# Altium schematic sheet CMV4000.SchDoc
size A4
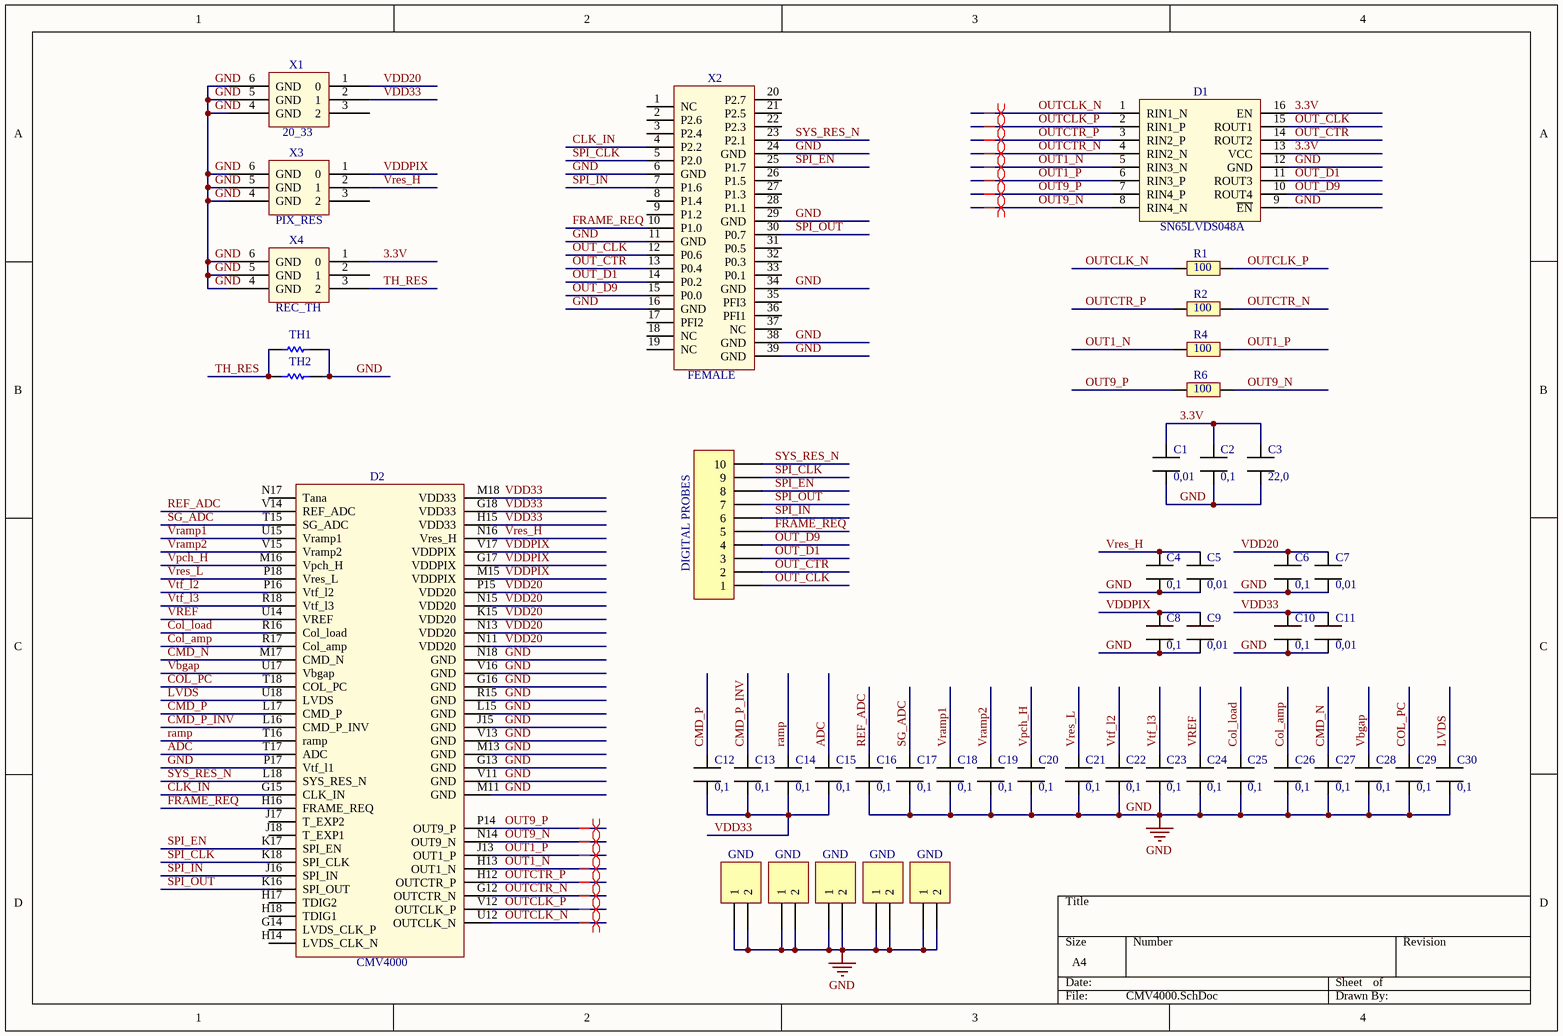
[diagram p0: CMV4000.SchDoc]

## Parts
C1  0,01  [CAP_SMALL]
C2  0,1  [CAP_SMALL]
C3  22,0  [Cap_BIG]
C4  0,1  [CAP_SMALL]
C5  0,01  [CAP_SMALL]
C6  0,1  [CAP_SMALL]
C7  0,01  [CAP_SMALL]
C8  0,1  [CAP_SMALL]
C9  0,01  [CAP_SMALL]
C10  0,1  [CAP_SMALL]
C11  0,01  [CAP_SMALL]
C12  0,1  [CAP_SMALL]
C13  0,1  [CAP_SMALL]
C14  0,1  [CAP_SMALL]
C15  0,1  [CAP_SMALL]
C16  0,1  [CAP_SMALL]
C17  0,1  [CAP_SMALL]
C18  0,1  [CAP_SMALL]
C19  0,1  [CAP_SMALL]
C20  0,1  [CAP_SMALL]
C21  0,1  [CAP_SMALL]
C22  0,1  [CAP_SMALL]
C23  0,1  [CAP_SMALL]
C24  0,1  [CAP_SMALL]
C25  0,1  [CAP_SMALL]
C26  0,1  [CAP_SMALL]
C27  0,1  [CAP_SMALL]
C28  0,1  [CAP_SMALL]
C29  0,1  [CAP_SMALL]
C30  0,1  [CAP_SMALL]
D1  SN65LVDS048A  [SN65LVDS048A (4LVDS)]
D2  CMV4000  [SOCKET_AM2]
P1  GND  [HDR1X2]
P2  GND  [HDR1X2]
P3  GND  [HDR1X2]
P4  GND  [HDR1X2]
P5  GND  [HDR1X2]
P6  DIGITAL PROBES  [HDR1X10]
R1  100  [RES]
R2  100  [RES]
R4  100  [RES]
R6  100  [RES]
TH1  Res Semi  [AXIAL-0.5]  (value not drawn)
TH2  Res Semi  [AXIAL-0.5]  (value not drawn)
X1  20_33  [POWER]
X2  FEMALE  [CHEAP_CONN_FEMALE]
X3  PIX_RES  [POWER]
X4  REC_TH  [POWER]

## Nets
GND: C1.1 C2.1 C3.1 C4.1 C5.1 C6.1 C7.1 C8.1 C9.1 C10.1 C11.1 C16.1 C17.1 C18.1 C19.1 C20.1 C21.1 C22.1 C23.1 C24.1 C25.1 C26.1 C27.1 C28.1 C29.1 C30.1 D1.9(~{EN}) D1.12(GND) D2.G13(GND) D2.G16(GND) D2.J15(GND) D2.L15(GND) D2.M11(GND) D2.M13(GND) D2.N18(GND) D2.P17(Vtf_l1) D2.R15(GND) D2.V11(GND) D2.V13(GND) D2.V16(GND) P1.1 P1.2 P2.1 P2.2 P3.1 P3.2 P4.1 P4.2 P5.1 P5.2 TH1.2 TH2.2 X1.4(GND) X1.5(GND) X1.6(GND) X2.6(GND) X2.11(GND) X2.16(GND) X2.24(GND) X2.29(GND) X2.34(GND) X2.38(GND) X2.39(GND) X3.4(GND) X3.5(GND) X3.6(GND) X4.4(GND) X4.5(GND) X4.6(GND)
3.3V: C1.2 C2.2 C3.2 D1.13(VCC) D1.16(EN) X4.1(0)
ADC: C15.2 D2.T17(ADC)
CLK_IN: D2.G15(CLK_IN) X2.4(P2.2)
CMD_N: C27.2 D2.M17(CMD_N)
CMD_P: C12.2 D2.L17(CMD_P)
CMD_P_INV: C13.2 D2.L16(CMD_P_INV)
Col_amp: C26.2 D2.R17(Col_amp)
Col_load: C25.2 D2.R16(Col_load)
COL_PC: C29.2 D2.T18(COL_PC)
FRAME_REQ: D2.H16(FRAME_REQ) P6.5 X2.10(P1.0)
LVDS: C30.2 D2.U18(LVDS)
OUT1_N: D1.5(RIN3_N) D2.H13(OUT1_N) R4.1
OUT1_P: D1.6(RIN3_P) D2.J13(OUT1_P) R4.2
OUT9_N: D1.8(RIN4_N) D2.N14(OUT9_N) R6.2
OUT9_P: D1.7(RIN4_P) D2.P14(OUT9_P) R6.1
OUT_CLK: D1.15(ROUT1) P6.1 X2.12(P0.6)
OUT_CTR: D1.14(ROUT2) P6.2 X2.13(P0.4)
OUT_D1: D1.11(ROUT3) P6.3 X2.14(P0.2)
OUT_D9: D1.10(ROUT4) P6.4 X2.15(P0.0)
OUTCLK_N: D1.1(RIN1_N) D2.U12(OUTCLK_N) R1.1
OUTCLK_P: D1.2(RIN1_P) D2.V12(OUTCLK_P) R1.2
OUTCTR_N: D1.4(RIN2_N) D2.G12(OUTCTR_N) R2.2
OUTCTR_P: D1.3(RIN2_P) D2.H12(OUTCTR_P) R2.1
ramp: C14.2 D2.T16(ramp)
REF_ADC: C16.2 D2.V14(REF_ADC)
SG_ADC: C17.2 D2.T15(SG_ADC)
SPI_CLK: D2.K18(SPI_CLK) P6.9 X2.5(P2.0)
SPI_EN: D2.K17(SPI_EN) P6.8 X2.25(P1.7)
SPI_IN: D2.J16(SPI_IN) P6.6 X2.7(P1.6)
SPI_OUT: D2.K16(SPI_OUT) P6.7 X2.30(P0.7)
SYS_RES_N: D2.L18(SYS_RES_N) P6.10 X2.23(P2.1)
TH_RES: TH1.1 TH2.1 X4.3(2)
Vbgap: C28.2 D2.U17(Vbgap)
VDD20: C6.2 C7.2 D2.K15(VDD20) D2.N11(VDD20) D2.N13(VDD20) D2.N15(VDD20) D2.P15(VDD20) X1.1(0)
VDD33: C10.2 C11.2 C12.1 C13.1 C14.1 C15.1 D2.G18(VDD33) D2.H15(VDD33) D2.M18(VDD33) X1.2(1)
VDDPIX: C8.2 C9.2 D2.G17(VDDPIX) D2.M15(VDDPIX) D2.V17(VDDPIX) X3.1(0)
Vpch_H: C20.2 D2.M16(Vpch_H)
Vramp1: C18.2 D2.U15(Vramp1)
Vramp2: C19.2 D2.V15(Vramp2)
VREF: C24.2 D2.U14(VREF)
Vres_H: C4.2 C5.2 D2.N16(Vres_H) X3.2(1)
Vres_L: C21.2 D2.P18(Vres_L)
Vtf_l2: C22.2 D2.P16(Vtf_l2)
Vtf_l3: C23.2 D2.R18(Vtf_l3)

Not connected (* = marked no-connect by the designer): D2 G14(LVDS_CLK_P) H14(LVDS_CLK_N) H17(TDIG2) H18(TDIG1) J17(T_EXP2) J18(T_EXP1) N17(Tana); X1 3(2); X2 1(NC) 2(P2.6) 3(P2.4) 8(P1.4) 9(P1.2) 17(PFI2) 18(NC) 19(NC) 20(P2.7) 21(P2.5) 22(P2.3) 26(P1.5) 27(P1.3) 28(P1.1) 31(P0.5) 32(P0.3) 33(P0.1) 35(PFI3) 36(PFI1) 37(NC); X3 3(2); X4 2(1)

## Layout directives
differential pair: OUT1_N, OUT1_P, OUT9_N, OUT9_P, OUTCLK_N, OUTCLK_P, OUTCTR_N, OUTCTR_P

## Library data of the parts
C1 C2 C4-C30 = CAP_SMALL
C3 = CAP_BIG
D1 = SN65LVDS048A (4LVDS)
P1-P5 = Header 2: Header, 2-Pin; LatestRevisionDate: 17-Jul-2002; LatestRevisionNote: Re-released for DXP Platform.; Publisher: Altium Limited
P6 = Header 10: Header, 10-Pin; LatestRevisionDate: 17-Jul-2002; LatestRevisionNote: Re-released for DXP Platform.; Publisher: Altium Limited
R1 R2 R4 R6 = RES
TH1 TH2 = Res Semi: Semiconductor Resistor; Value: 1K; Published: 8-Jun-2000; LatestRevisionDate: 17-Jul-2002; LatestRevisionNote: Re-released for DXP Platform.; PackageReference: AXIAL-0.5; Publisher: Altium Limited; PackageDescription: Axial Device, Thru-Hole; 2 Leads; 0.5 in Pin Spacing
X1 X3 X4 = POWER
X2 = CHEAP_CON_37_FEMALE